# EasyEDA schematic SCH_LoRaRice(Node)_2024-06-10.json
TITLE: Node PCB; REV: 1.0; Date: 2024-05-26; Sheet: 1/1; Drawn By: Teeraphat Thongchern; Company: LoRaRice_Node
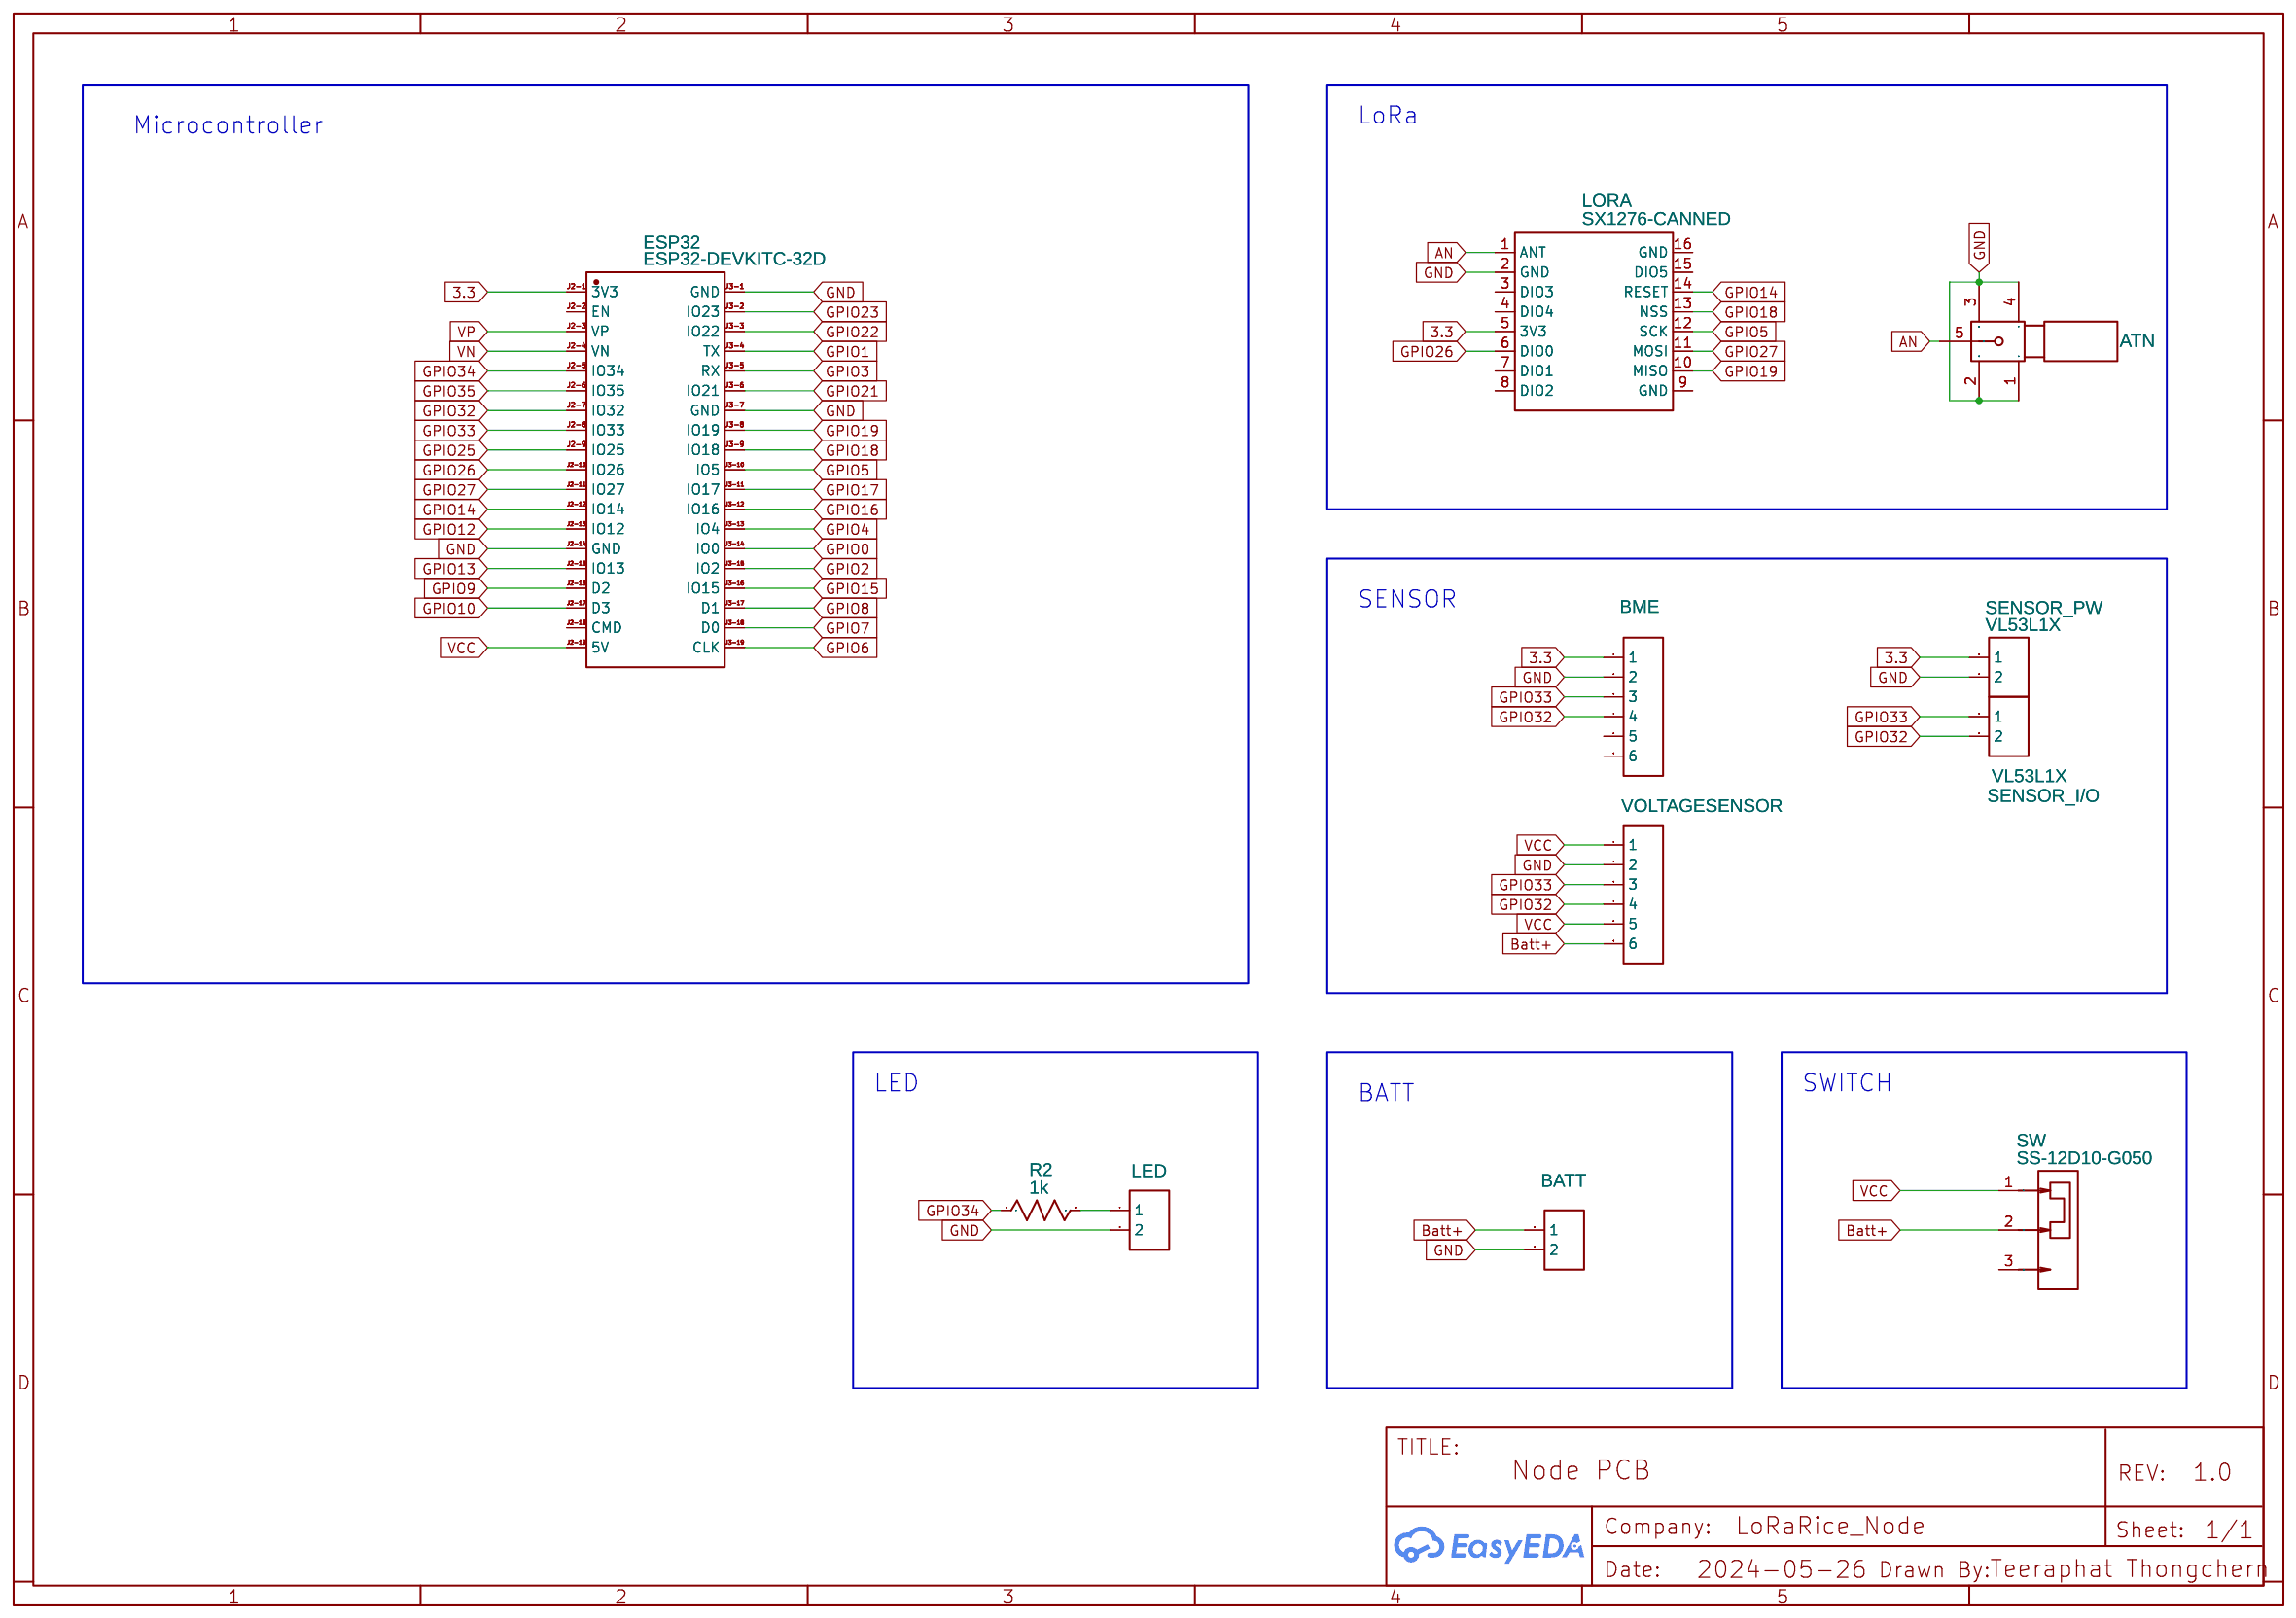
[diagram p0: schematic sheet]

## Parts
ATN  ATN  [SMA-SMD_BWSMA-KE-P001]
BATT  VL53L1X  [CONN-TH_2P-P5.00]
BME  00  [HDR-F-2.54_1X6]
ESP32  ESP32-DEVKITC-32D  [COMM-SMD_ESP32-DEVKITC-32D]
LED  HDR-F-2.54_1x2  [HDR-F-2.54_1X2]
LORA  SX1276-CANNED  [SX1276-CANNED]
R2  1k  [R_AXIAL-0.4]
SENSOR_I/O  VL53L1X  [CONN-TH_2P-P5.00]
SENSOR_PW  VL53L1X  [CONN-TH_2P-P5.00]
SW  SS-12D10-G050  [SW-TH_SS-12D10-G050]
VOLTAGESENSOR  00  [HDR-F-2.54_1X6]

## Library data of the parts
ATN = BWSMA-KE-P001: Contributor: LCSC; Supplier: LCSC; Supplier Part: C496550; Manufacturer: BAT WIRELESS(蝙蝠无线); JLCPCB Part Class: Extended Part
BATT SENSOR_I/O SENSOR_PW = CONN-TH_2P-P5.00: Supplier: LCSC; Contributor: LCEDA_Lib
BME VOLTAGESENSOR = HDR-F-2.54_1x6: Supplier Part: C40877; Supplier: LCSC; Contributor: LCEDA_Lib
ESP32 = ESP32-DEVKITC-32D: Supplier: LCSC; Supplier Part: C571181; Manufacturer: ESPRESSIF(乐鑫); Manufacturer Part: ESP32-DevKitC-32D; JLCPCB Part Class: Extended Part; Contributor: lcsc
LED = HDR-F-2.54_1x2: Supplier Part: C49661; Supplier: LCSC; Contributor: LCEDA_Lib
LORA = SX1276-CANNED: Manufacturer: G-NiceRF; Manufacturer Part: LoRa1276-C1; Supplier: Banggood; Supplier Part: Unknown; link: https://uk.banggood.com/LoRa1276-C1-SX1276-868MHz-LoRa-Module-Remote-Spread-Spectrum-Wireless-Module-20dBm-100mW-3-5KM-p-1416393.html?gmcCountry=GB¤cy=GBP&createTmp=1&utm_source=googleshopping&utm_medium=cpc_bgcs&utm_content=garman&utm_campaign=pla-gbg-ele-pc&gclid=EAIaIQobChMIouzku5XS4gIVipTtCh1cvgo9EAYYByABEgJIPfD_BwE&cur_warehouse=CN; Contributor: P-Thomsen
R2 = R_AXIAL-0.4_US: Contributor: LCEDA_Lib
SW = SS-12D10-G050: Contributor: LCSC; Supplier: LCSC; Supplier Part: C2848933; Manufacturer: G-Switch(品赞); JLCPCB Part Class: Extended Part

## Nets
GND: ATN.1 ATN.2 ATN.3 ATN.4 BATT.2 BME.2 ESP32.J2-14(GND) ESP32.J3-1(GND) ESP32.J3-7(GND) LED.2 LORA.2(GND) SENSOR_PW.2 VOLTAGESENSOR.2
VCC: ESP32.J2-19(5V) SW.1 VOLTAGESENSOR.1 VOLTAGESENSOR.5
3.3: BME.1 ESP32.J2-1(3V3) LORA.5(3V3) SENSOR_PW.1
AN: ATN.5 LORA.1(ANT)
Batt+: BATT.1 SW.2 VOLTAGESENSOR.6
GPIO0: ESP32.J3-14(IO0)
GPIO1: ESP32.J3-4(TX)
GPIO2: ESP32.J3-15(IO2)
GPIO3: ESP32.J3-5(RX)
GPIO4: ESP32.J3-13(IO4)
GPIO5: ESP32.J3-10(IO5) LORA.12(SCK)
GPIO6: ESP32.J3-19(CLK)
GPIO7: ESP32.J3-18(D0)
GPIO8: ESP32.J3-17(D1)
GPIO9: ESP32.J2-16(D2)
GPIO10: ESP32.J2-17(D3)
GPIO12: ESP32.J2-13(IO12)
GPIO13: ESP32.J2-15(IO13)
GPIO14: ESP32.J2-12(IO14) LORA.14(RESET)
GPIO15: ESP32.J3-16(IO15)
GPIO16: ESP32.J3-12(IO16)
GPIO17: ESP32.J3-11(IO17)
GPIO18: ESP32.J3-9(IO18) LORA.13(NSS)
GPIO19: ESP32.J3-8(IO19) LORA.10(MISO)
GPIO21: ESP32.J3-6(IO21)
GPIO22: ESP32.J3-3(IO22)
GPIO23: ESP32.J3-2(IO23)
GPIO25: ESP32.J2-9(IO25)
GPIO26: ESP32.J2-10(IO26) LORA.6(DIO0)
GPIO27: ESP32.J2-11(IO27) LORA.11(MOSI)
GPIO32: BME.4 ESP32.J2-7(IO32) SENSOR_I/O.2 VOLTAGESENSOR.4
GPIO33: BME.3 ESP32.J2-8(IO33) SENSOR_I/O.1 VOLTAGESENSOR.3
GPIO34: ESP32.J2-5(IO34) R2.1
GPIO35: ESP32.J2-6(IO35)
VN: ESP32.J2-4(VN)
VP: ESP32.J2-3(VP)
Net-(LED-1): LED.1 R2.2

Not connected (* = marked no-connect by the designer): BME 5 6; ESP32 J2-2(EN) J2-18(CMD); LORA 3(DIO3) 4(DIO4) 7(DIO1) 8(DIO2) 9(GND) 15(DIO5) 16(GND); SW 3

## Notes on the sheet
- Microcontroller
- LoRa
- SENSOR
- LED
- SWITCH
- BATT
